# EAGLE design magnetoV2.0 (EAGLE 9.1.0)
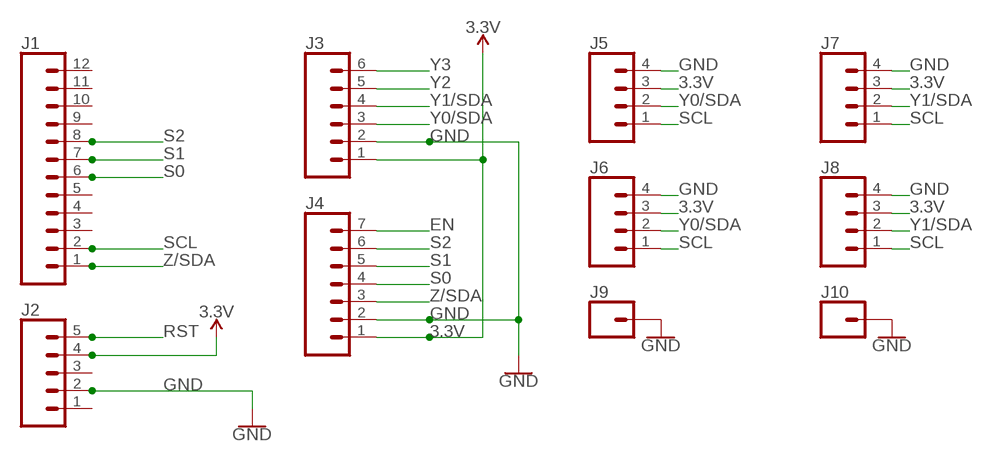
[diagram p0: schematic, sheet 1]

## Parts
J1  CONN_12  [1X12]
J2  CONN_05  [1X05]
J3  CONN_06SILK_FEMALE_PTH  [1X06]
J4  CONN_07  [1X07]
J5  CONN_04  [1X04]
J6  CONN_04  [1X04]
J7  CONN_04  [1X04]
J8  CONN_04  [1X04]
J9  CONN_01  [1X01]
J10  CONN_01  [1X01]

## Nets
3.3V: J2.4 J3.1 J4.1 J5.3 J6.3 J7.3 J8.3
EN: J4.7
GND: J2.2 J3.2 J4.2 J5.4 J6.4 J7.4 J8.4 J9.1 J10.1
RST: J2.5
S0: J1.6 J4.4
S1: J1.7 J4.5
S2: J1.8 J4.6
SCL: J1.2 J5.1 J6.1 J7.1 J8.1
Y0/SDA: J3.3 J5.2 J6.2
Y1/SDA: J3.4 J7.2 J8.2
Y2: J3.5
Y3: J3.6
Z/SDA: J1.1 J4.3
Unconnected: J1.3 J1.4 J1.5 J1.9 J1.10 J1.11 J1.12 J2.1 J2.3

## Library data of the parts
J1 = SparkFun-Connectors:CONN_12: Multi connection point. Often used as Generic Header-pin footprint for 0.1 inch spaced/style header connections On any of the 0.1 inch spaced packages, you can populate with these: Break Away Headers - Straight <https://www.sparkfun.com/products/116> (PRT-00116) Break Away Male Headers - Right Angle <https://www.sparkfun.com/products/553> (PRT-00553) Female Headers <https://www.sparkfun.com/products/115> (PRT-00115) Break Away Headers - Machine Pin <https://www.sparkfun.com/products/117> (PRT-00117) Break Away Female Headers - Swiss Machine Pin <https://www.sparkfun.com/products/743> (PRT-00743) For SCREWTERMINALS and SPRING TERMINALS visit here: Screw Terimnals on SparkFun.com <https://www.sparkfun.com/search/results?term=Screw+Terminals> (5mm/3.5mm/2.54mm spacing) This device is also useful as a general connection point to wire up your design to another part of your project. Our various solder wires solder well into these plated through hole pads. Hook-Up Wire - Assortment (Stranded, 22 AWG) <https://www.sparkfun.com/products/11375> (PRT-11375) Hook-Up Wire - Assortment (Solid Core, 22 AWG) <https://www.sparkfun.com/products/11367> (PRT-11367) View the entire wire category on our website here <https://www.sparkfun.com/categories/141> Special notes: Molex polarized connector foot print use with SKU : PRT-08231 with associated crimp pins and housings. 1MM SMD Version SKU: PRT-10208 NOTES ON THE VARIANTS LOCK and LOCK_LONGPADS... This footprint was designed to help hold the alignment of a through-hole component (i.e. 6-pin header) while soldering it into place. You may notice that each hole has been shifted either up or down by 0.005 of an inch from it's more standard position (which is a perfectly straight line). This slight alteration caused the pins (the squares in the middle) to touch the edges of the holes. Because they are alternating, it causes a "brace" to hold the component in place. 0.005 has proven to be the perfect amount of "off-center" position when using our standard breakaway headers. Although looks a little odd when you look at the bare footprint, once you have a header in there, the alteration is very hard to notice. Also,if you push a header all the way into place, it is covered up entirely on the bottom side.
J2 = SparkFun-Connectors:CONN_05: Multi connection point. Often used as Generic Header-pin footprint for 0.1 inch spaced/style header connections On any of the 0.1 inch spaced packages, you can populate with these: Break Away Headers - Straight <https://www.sparkfun.com/products/116> (PRT-00116) Break Away Male Headers - Right Angle <https://www.sparkfun.com/products/553> (PRT-00553) Female Headers <https://www.sparkfun.com/products/115> (PRT-00115) Break Away Headers - Machine Pin <https://www.sparkfun.com/products/117> (PRT-00117) Break Away Female Headers - Swiss Machine Pin <https://www.sparkfun.com/products/743> (PRT-00743) For SCREWTERMINALS and SPRING TERMINALS visit here: Screw Terimnals on SparkFun.com <https://www.sparkfun.com/search/results?term=Screw+Terminals> (5mm/3.5mm/2.54mm spacing) This device is also useful as a general connection point to wire up your design to another part of your project. Our various solder wires solder well into these plated through hole pads. Hook-Up Wire - Assortment (Stranded, 22 AWG) <https://www.sparkfun.com/products/11375> (PRT-11375) Hook-Up Wire - Assortment (Solid Core, 22 AWG) <https://www.sparkfun.com/products/11367> (PRT-11367) View the entire wire category on our website here <https://www.sparkfun.com/categories/141> Special notes: Molex polarized connector foot print use with SKU : PRT-08231 with associated crimp pins and housings. 1MM SMD Version SKU: PRT-10208
J3 = SparkFun-Connectors:CONN_06: Multi connection point. Often used as Generic Header-pin footprint for 0.1 inch spaced/style header connections On any of the 0.1 inch spaced packages, you can populate with these: Break Away Headers - Straight <https://www.sparkfun.com/products/116> (PRT-00116) Break Away Male Headers - Right Angle <https://www.sparkfun.com/products/553> (PRT-00553) Female Headers <https://www.sparkfun.com/products/115> (PRT-00115) Break Away Headers - Machine Pin <https://www.sparkfun.com/products/117> (PRT-00117) Break Away Female Headers - Swiss Machine Pin <https://www.sparkfun.com/products/743> (PRT-00743) Arduino Stackable Header - 6 Pin <https://www.sparkfun.com/products/9280> (PRT-09280) For SCREWTERMINALS and SPRING TERMINALS visit here: Screw Terimnals on SparkFun.com <https://www.sparkfun.com/search/results?term=Screw+Terminals> (5mm/3.5mm/2.54mm spacing) This device is also useful as a general connection point to wire up your design to another part of your project. Our various solder wires solder well into these plated through hole pads. Hook-Up Wire - Assortment (Stranded, 22 AWG) <https://www.sparkfun.com/products/11375> (PRT-11375) Hook-Up Wire - Assortment (Solid Core, 22 AWG) <https://www.sparkfun.com/products/11367> (PRT-11367) View the entire wire category on our website here <https://www.sparkfun.com/categories/141>; PROD_ID: CONN-08437
J4 = SparkFun-Connectors:CONN_07: Multi connection point. Often used as Generic Header-pin footprint for 0.1 inch spaced/style header connections On any of the 0.1 inch spaced packages, you can populate with these: Break Away Headers - Straight <https://www.sparkfun.com/products/116> (PRT-00116) Break Away Male Headers - Right Angle <https://www.sparkfun.com/products/553> (PRT-00553) Female Headers <https://www.sparkfun.com/products/115> (PRT-00115) Break Away Headers - Machine Pin <https://www.sparkfun.com/products/117> (PRT-00117) Break Away Female Headers - Swiss Machine Pin <https://www.sparkfun.com/products/743> (PRT-00743) For SCREWTERMINALS and SPRING TERMINALS visit here: Screw Terimnals on SparkFun.com <https://www.sparkfun.com/search/results?term=Screw+Terminals> (5mm/3.5mm/2.54mm spacing) This device is also useful as a general connection point to wire up your design to another part of your project. Our various solder wires solder well into these plated through hole pads. Hook-Up Wire - Assortment (Stranded, 22 AWG) <https://www.sparkfun.com/products/11375> (PRT-11375) Hook-Up Wire - Assortment (Solid Core, 22 AWG) <https://www.sparkfun.com/products/11367> (PRT-11367) View the entire wire category on our website here <https://www.sparkfun.com/categories/141> Special notes: Molex polarized connector foot print use with SKU : PRT-08231 with associated crimp pins and housings. 1MM SMD Version SKU: PRT-10208 NOTES ON THE VARIANTS LOCK and LOCK_LONGPADS... This footprint was designed to help hold the alignment of a through-hole component (i.e. 6-pin header) while soldering it into place. You may notice that each hole has been shifted either up or down by 0.005 of an inch from it's more standard position (which is a perfectly straight line). This slight alteration caused the pins (the squares in the middle) to touch the edges of the holes. Because they are alternating, it causes a "brace" to hold the component in place. 0.005 has proven to be the perfect amount of "off-center" position when using our standard breakaway headers. Although looks a little odd when you look at the bare footprint, once you have a header in there, the alteration is very hard to notice. Also,if you push a header all the way into place, it is covered up entirely on the bottom side.
J5-J8 = SparkFun-Connectors:CONN_04: Multi connection point. Often used as Generic Header-pin footprint for 0.1 inch spaced/style header connections On any of the 0.1 inch spaced packages, you can populate with these: Break Away Headers - Straight <https://www.sparkfun.com/products/116> (PRT-00116) Break Away Male Headers - Right Angle <https://www.sparkfun.com/products/553> (PRT-00553) Female Headers <https://www.sparkfun.com/products/115> (PRT-00115) Break Away Headers - Machine Pin <https://www.sparkfun.com/products/117> (PRT-00117) Break Away Female Headers - Swiss Machine Pin <https://www.sparkfun.com/products/743> (PRT-00743) For SCREWTERMINALS and SPRING TERMINALS visit here: Screw Terimnals on SparkFun.com <https://www.sparkfun.com/search/results?term=Screw+Terminals> (5mm/3.5mm/2.54mm spacing) This device is also useful as a general connection point to wire up your design to another part of your project. Our various solder wires solder well into these plated through hole pads. Hook-Up Wire - Assortment (Stranded, 22 AWG) <https://www.sparkfun.com/products/11375> (PRT-11375) Hook-Up Wire - Assortment (Solid Core, 22 AWG) <https://www.sparkfun.com/products/11367> (PRT-11367) View the entire wire category on our website here <https://www.sparkfun.com/categories/141> Special notes: Molex polarized connector foot print use with SKU : PRT-08231 with associated crimp pins and housings. 1MM SMD Version SKU: PRT-10208; PROD_ID: CONN-09696
J9 J10 = SparkFun-Connectors:CONN_01: Single connection point. Often used as Generic Header-pin footprint for 0.1 inch spaced/style header connections On any of the 0.1 inch spaced packages, you can populate with these: Break Away Headers - Straight <https://www.sparkfun.com/products/116> (PRT-00116) Break Away Male Headers - Right Angle <https://www.sparkfun.com/products/553> (PRT-00553) Female Headers <https://www.sparkfun.com/products/115> (PRT-00115) Break Away Headers - Machine Pin <https://www.sparkfun.com/products/117> (PRT-00117) Break Away Female Headers - Swiss Machine Pin <https://www.sparkfun.com/products/743> (PRT-00743) This device is also useful as a general connection point to wire up your design to another part of your project. Our various solder wires solder well into these plated through hole pads. Hook-Up Wire - Assortment (Stranded, 22 AWG) <https://www.sparkfun.com/products/11375> (PRT-11375) Hook-Up Wire - Assortment (Solid Core, 22 AWG) <https://www.sparkfun.com/products/11367> (PRT-11367) View the entire wire category on our website here <https://www.sparkfun.com/categories/141> Special notes: SMTSO-256-ET is a "flush mount" nut for a 4-40 screw. We mostly use this on specialty testbeds; it is a nice way to connect hardware to your PCB at an adjustable hieght. Also note, the SNAP packages are for using a snappable style connector. We sell a baggie of snaps and they are also used on two LilyPad designs: Snap Assortment - 30 pack (male and female) <https://www.sparkfun.com/products/11347> (DEV-11347) LilyPad Arduino SimpleSnap <https://www.sparkfun.com/products/10941> (DEV-10941) LilyPad SimpleSnap Protoboard <https://www.sparkfun.com/products/10940> (DEV-10940)

## Net classes
0 default: width 0.254 mm, drill 0.203 mm, clearance 0.254 mm

## Board
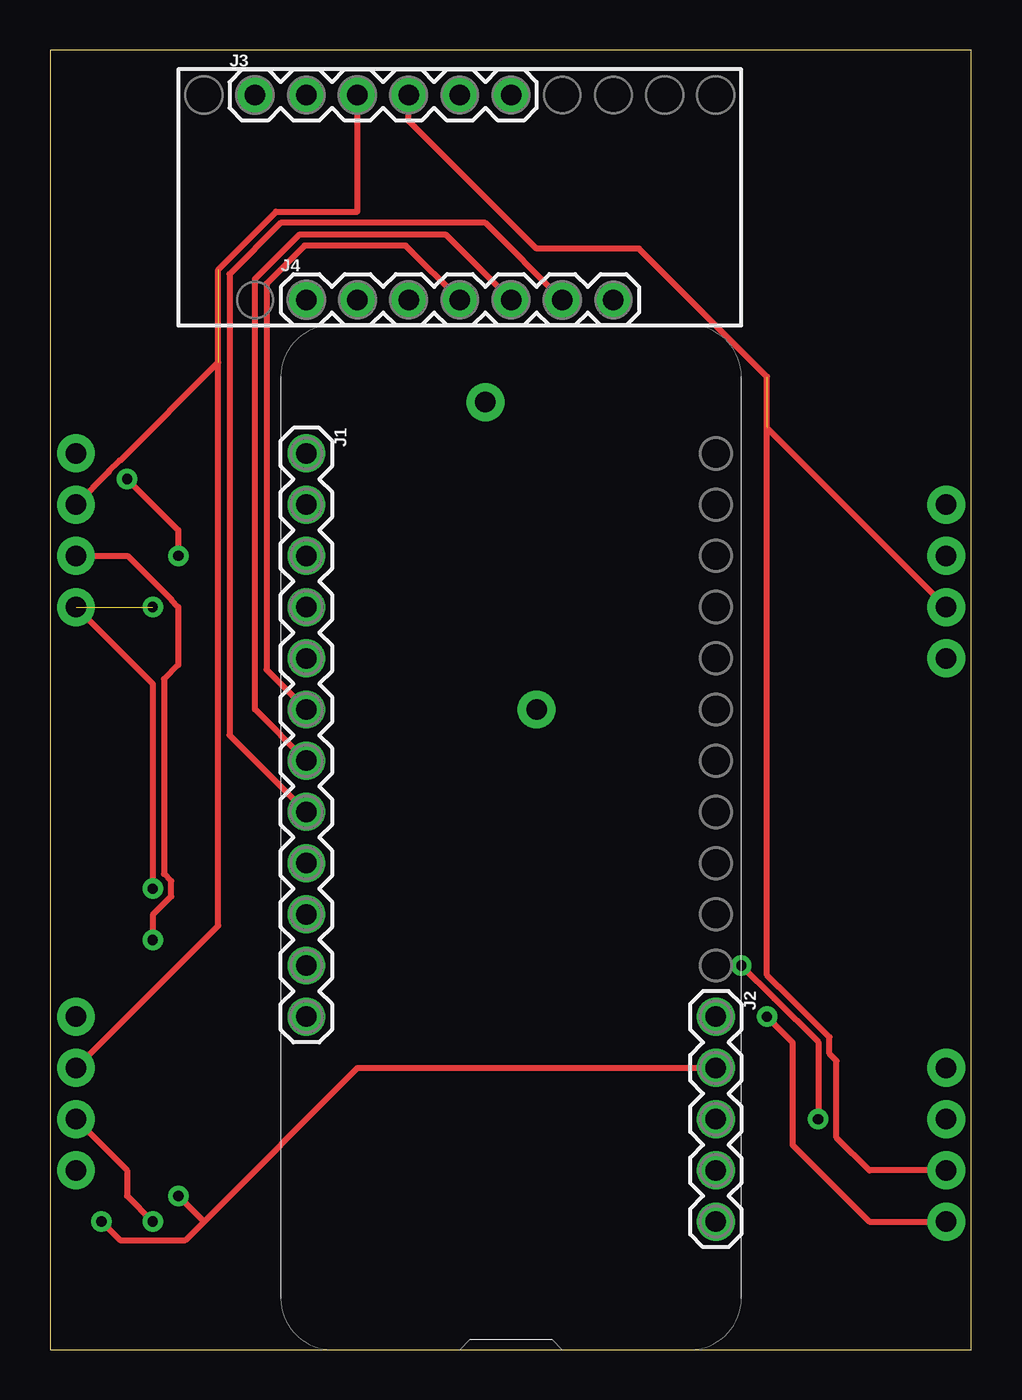
[diagram p1: board, top side]
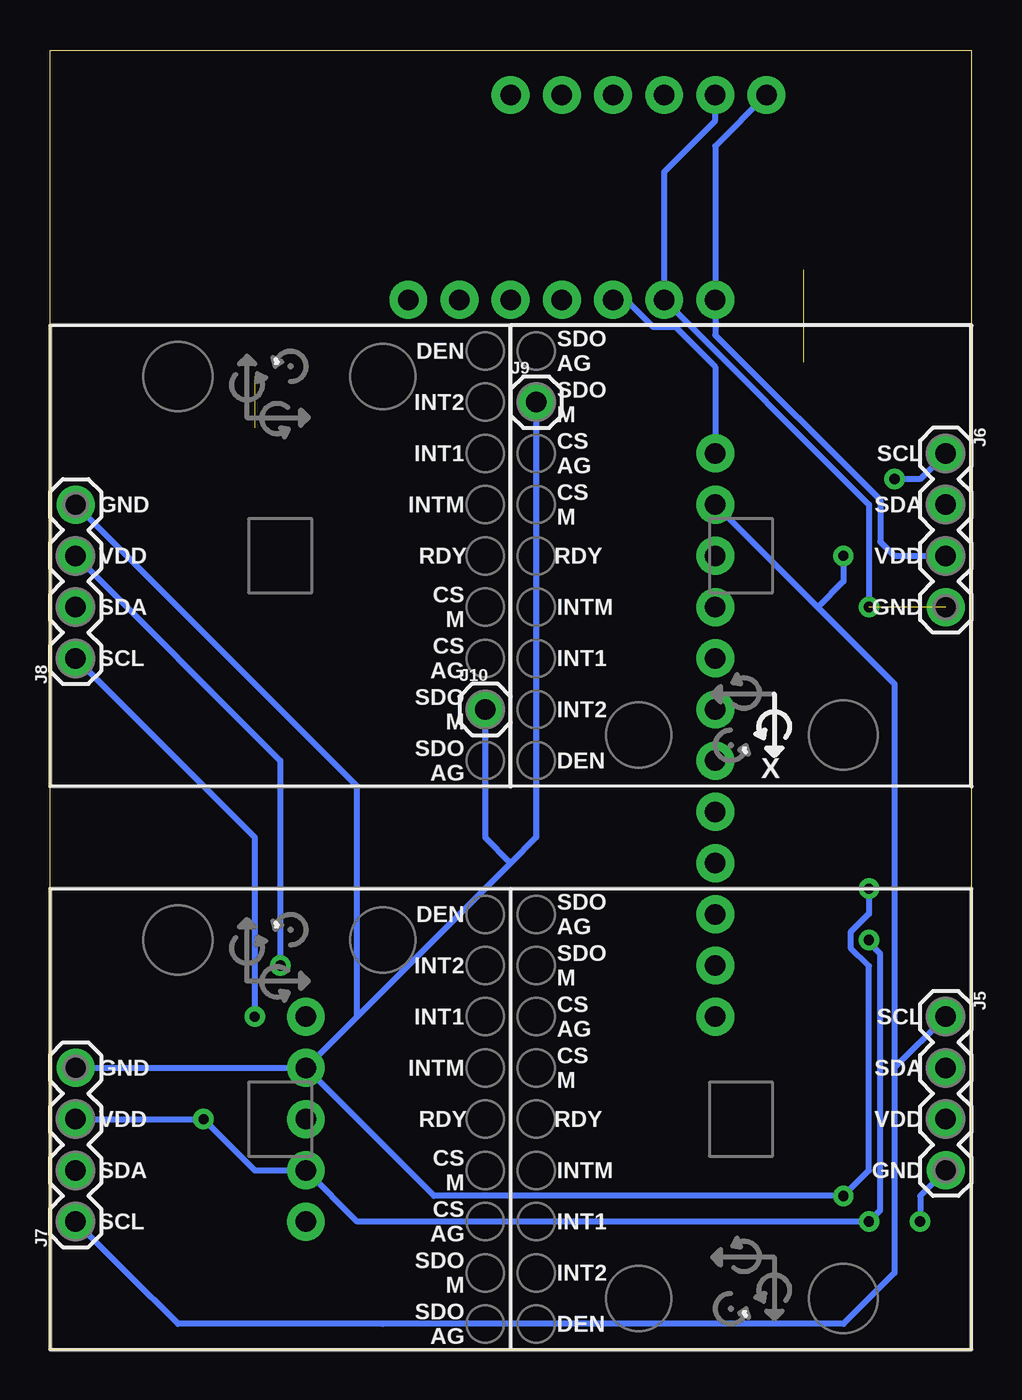
[diagram p2: board, bottom side, seen from below]

Size 45.7 x 64.44 mm. Coordinates in mm from the lower left corner, seen from the top.
Outline: 0,0 45.7,0 45.7,64.44 0,64.44 0,0
Copper layers (1*16): Top 0.035mm / dielectric 1.5mm / Bottom 0.035mm
Design rules "SparkFun": minimum track width 8mil, minimum drill 20mil, track to track 8mil, track to pad 8mil, pad to pad 8mil, via to via 8mil, smd to smd 8mil, copper to edge 10mil, drill to drill 8mil, minimum pad ring 12mil, minimum via ring 10mil, stop-mask expansion 4mil, vias tented up to drill 25mil, thermal gap 10mil
tKeepout: area 15.2,26.7 to 30.5,50.8

### Footprints (pad centres in the part's own frame; a part is rotated, then mirrored left to right if it is on the bottom)
1X12 = drill 1.016 pad 1.88: 1 0,0; 2 2.54,0; 3 5.08,0; 4 7.62,0; 5 10.16,0; 6 12.7,0; 7 15.24,0; 8 17.78,0; 9 20.32,0; 10 22.86,0; 11 25.4,0; 12 27.94,0
1X05 = drill 1.016 pad 1.88: 1 0,0; 2 2.54,0; 3 5.08,0; 4 7.62,0; 5 10.16,0
1X06 = drill 1.016 pad 1.88: 1 0,0; 2 2.54,0; 3 5.08,0; 4 7.62,0; 5 10.16,0; 6 12.7,0
1X07 = drill 1.016 pad 1.88: 1 0,0; 2 2.54,0; 3 5.08,0; 4 7.62,0; 5 10.16,0; 6 12.7,0; 7 15.24,0
1X04 = drill 1.016 pad 1.88: 1 0,0; 2 2.54,0; 3 5.08,0; 4 7.62,0
1X01 = drill 1.016 pad 1.88: 1 0,0

### Placement (x,y rotation side)
J1  12.7,44.45 270 top
J2  33.02,16.51 270 top
J3  10.16,62.23 0 top
J4  12.7,52.07 0 top
J5  1.27,16.51 270 bottom
J6  1.27,44.45 270 bottom
J7  44.45,6.35 90 bottom
J8  44.45,34.29 90 bottom
J9  21.59,46.99 0 bottom
J10  24.13,31.75 0 bottom

### Tracks (layer width: path | path; a pad name or v marks a point on that pad's centre or on a via)
3.3V  (via drill 0.51)
  Top 0.305: 3.81,8.89 J5.3 3.81,8.89 | v5.08,20.32 5.08,21.57 5.99,22.48 5.99,23.24 5.64,23.59 5.64,33.25 6.35,33.96 6.35,36.83 5.99,37.19 5.99,37.21 3.83,39.37 J6.3 | 3.81,8.89 3.81,7.62 v5.08,6.35 | v34.29,19.05 35.92,17.42 35.94,17.42 38.1,15.26 v38.1,11.43
  Bottom 0.305: J7.3 v38.1,11.43 35.56,8.89 J2.4 30.48,6.35 v5.08,6.35 4.52,6.91 4.52,19.64 5.08,20.2 v5.08,20.32 | J6.3 3.81,39.37 4.52,40.08 4.52,42.14 12.7,50.32 J4.1 12.7,59.69 J3.1 | J8.3 34.29,29.21 v34.29,19.05
GND  (via drill 0.51)  (1 unrouted)
  Top 0.305: J2.2 15.24,13.97 7.62,6.35 | J6.4 5.08,33.02 v5.08,22.86 | v6.35,7.62 7.62,6.35 | v2.54,6.35 3.45,5.44 6.71,5.44 7.62,6.35
  Bottom 0.305: J3.2 12.7,60.96 15.24,58.42 J4.2 5.08,41.91 v5.08,36.83 | J9.1 21.59,25.4 22.86,24.13 | 22.86,24.13 24.13,25.4 J10.1 | J7.4 J2.2 | J8.4 30.48,27.94 30.48,16.51 | J2.2 30.48,16.51 | 30.48,16.51 22.86,24.13 | J5.4 2.54,7.62 v2.54,6.35 | v5.08,22.86 5.08,21.61 5.99,20.7 5.99,19.94 5.08,19.03 5.08,8.89 v6.35,7.62 26.67,7.62 J2.2
S0
  Top 0.305: J1.6 10.72,33.73 10.72,52.88 12.6,54.76 17.63,54.76 J4.4
S1
  Top 0.305: J1.7 10.16,31.75 10.16,53.11 12.37,55.32 19.61,55.32 J4.5
S2
  Top 0.305: J4.6 21.59,55.88 11.43,55.88 8.89,53.34 8.89,30.48 J1.8
SCL  (via drill 0.51)
  Top 0.305: v3.81,43.18 6.35,40.64 v6.35,39.37 | v35.56,16.51 36.83,15.24 36.83,10.16 40.64,6.35 J7.1
  Bottom 0.305: 3.81,13.97 3.81,3.81 6.35,1.27 29.21,1.27 39.37,1.27 41.91,3.81 J7.1 | J5.1 3.81,13.97 | 3.81,13.97 3.81,33.02 7.62,36.83 | 7.62,36.83 J1.2 | J6.1 2.54,43.18 v3.81,43.18 | v6.35,39.37 6.35,38.1 7.62,36.83 | v35.56,16.51 35.56,25.4 J8.1
Y0/SDA  (1 unrouted)
  Top 0.305: J3.3 15.24,56.44 11.2,56.44 8.33,53.57 8.33,21.03 J5.2 | J6.2 2.9,43.54 2.9,43.56 3.43,44.09 3.45,44.09 8.33,48.97
Y1/SDA  (1 unrouted)
  Top 0.305: J8.2 41.91,39.37 35.56,45.72 | J3.4 17.78,60.96 24.13,54.61 29.21,54.61 35.56,48.26 35.56,18.57 36.15,17.98 36.17,17.98 38.66,15.49 38.66,14.68 39.01,14.33 39.01,10.52 40.64,8.89 J7.2
Z/SDA
  Bottom 0.305: J4.3 17.14,52.07 15.8,50.72 14.68,50.72 12.7,48.74 J1.1

### Text on the board
bPlace: SDO / AG | DEN | SDO / M | INT2 | SCL | CS / AG | INT1 | SDA | CS / M | INTM | GND | VDD | RDY | RDY | VDD | GND | INTM | CS / M | SDA | INT1 | CS / AG | SCL | INT2 | SDO / M | X | DEN | SDO / AG | SDO / AG | DEN | SDO / M | INT2 | SCL | CS / AG | INT1 | SDA | CS / M | INTM | GND | VDD | RDY | RDY | VDD | GND | INTM | CS / M | SDA | INT1 | CS / AG | SCL | INT2 | SDO / M | DEN | SDO / AG
bDocu: Z | X | Y | Y | Z | Z | X | Y | Y | Z | X